# EasyEDA schematic pixelpal.json

## Sheets
1 SHEET1: TITLE: SHEET1; REV: 1.0; Date: 2025-04-19; Sheet: 1/1; Drawn By: yasithlokuge; Company: Your Company
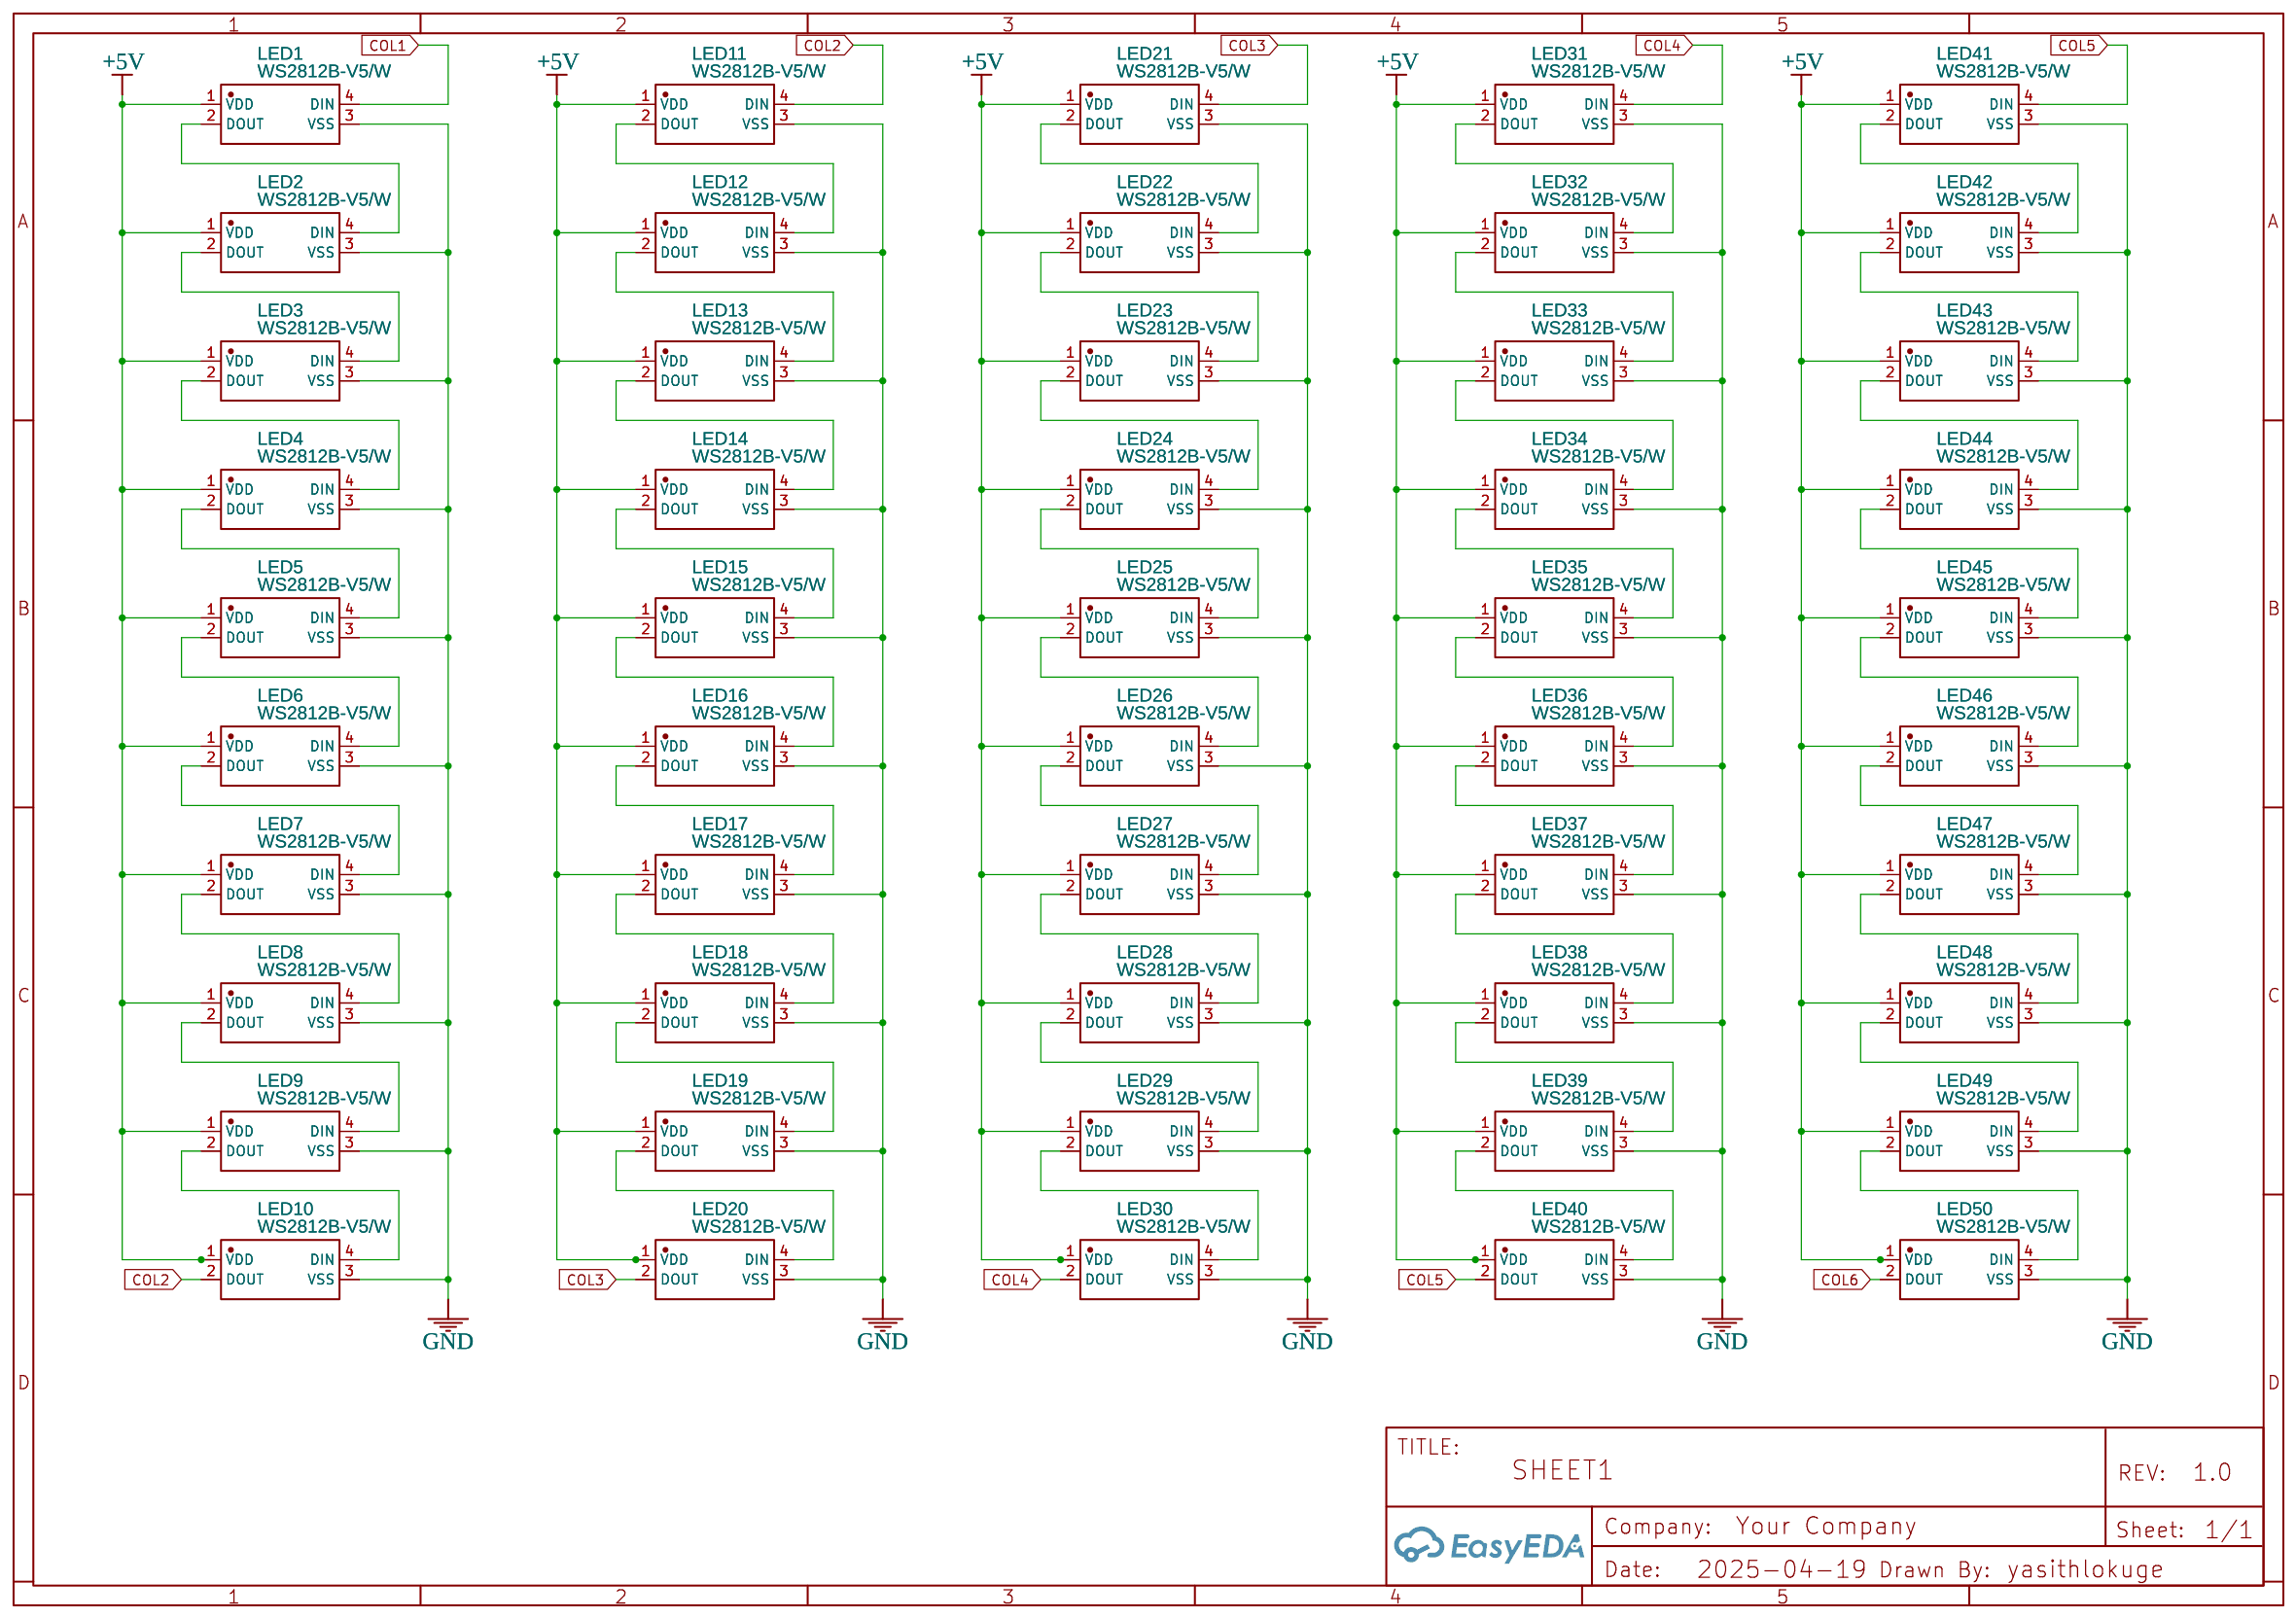
[diagram p0: SHEET1]
2 SHEET2
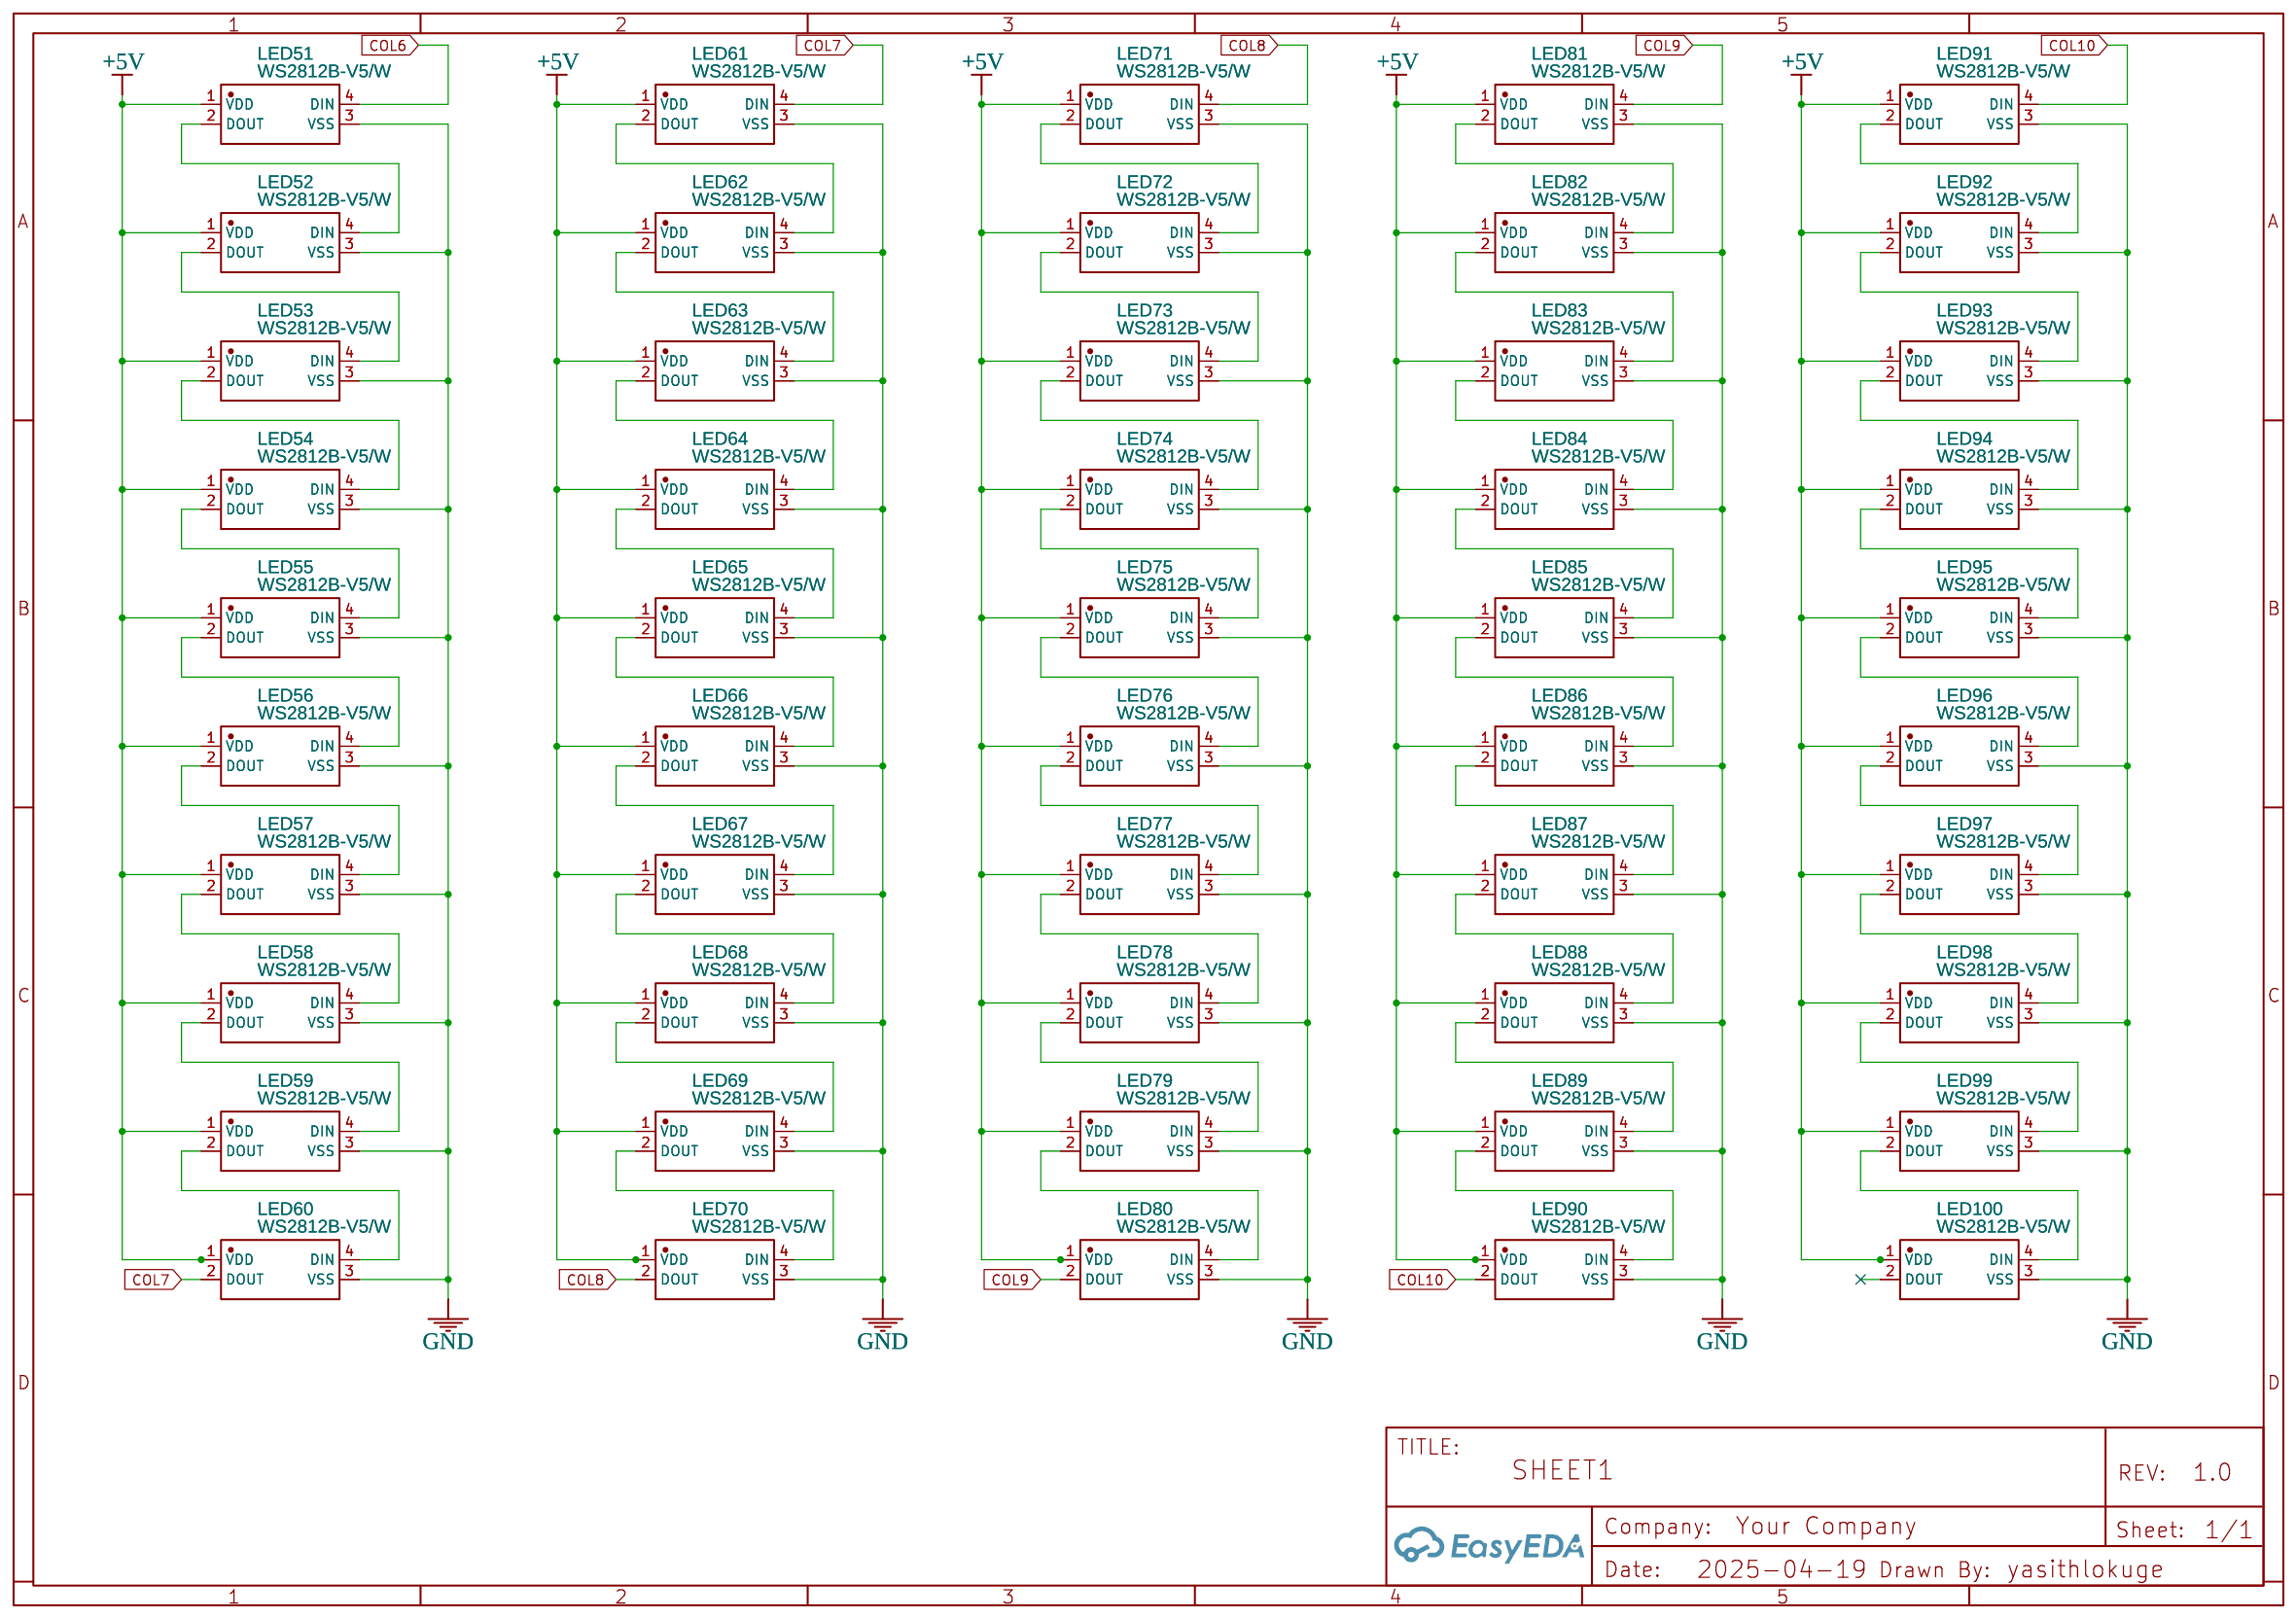
[diagram p1: SHEET2]
3 SHEET3: TITLE: Sheet_3; Date: 2025-04-22
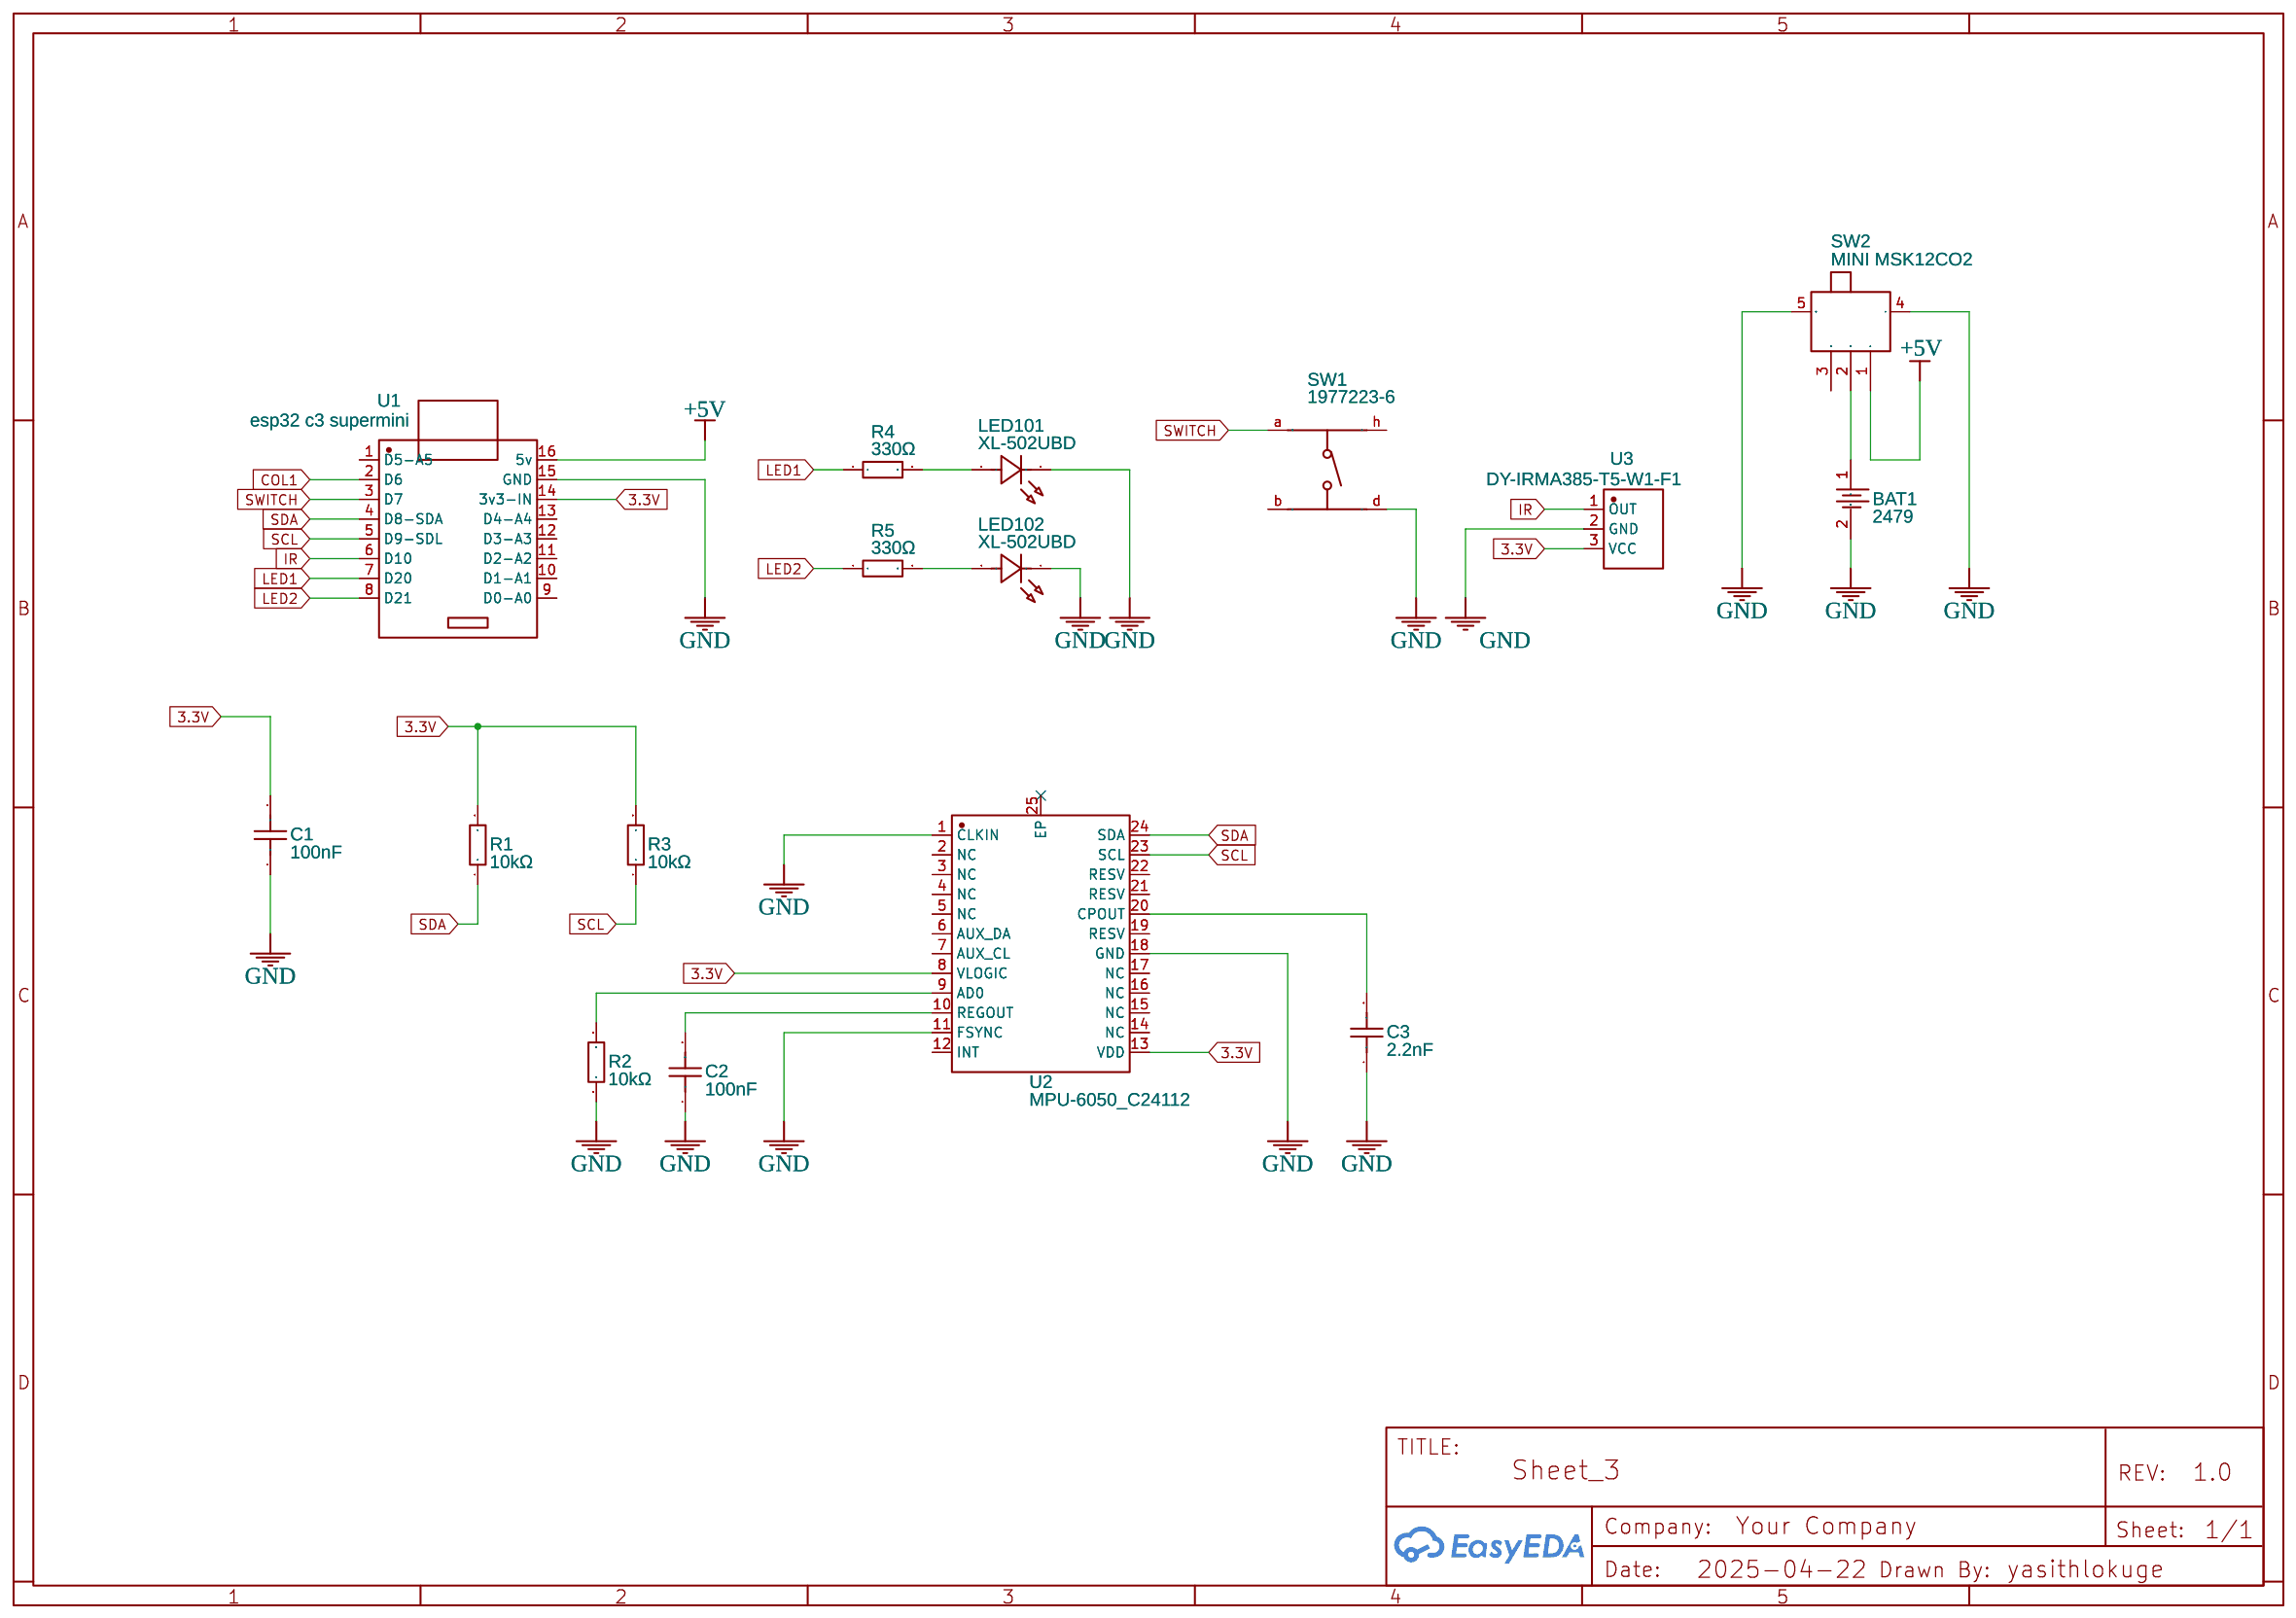
[diagram p2: SHEET3]

## Parts
sheet SHEET1
LED1  WS2812B-V5/W  [LED-SMD_4P-L5.0-W5.0-TL-1]
LED2  WS2812B-V5/W  [LED-SMD_4P-L5.0-W5.0-TL-1]
LED3  WS2812B-V5/W  [LED-SMD_4P-L5.0-W5.0-TL-1]
LED4  WS2812B-V5/W  [LED-SMD_4P-L5.0-W5.0-TL-1]
LED5  WS2812B-V5/W  [LED-SMD_4P-L5.0-W5.0-TL-1]
LED6  WS2812B-V5/W  [LED-SMD_4P-L5.0-W5.0-TL-1]
LED7  WS2812B-V5/W  [LED-SMD_4P-L5.0-W5.0-TL-1]
LED8  WS2812B-V5/W  [LED-SMD_4P-L5.0-W5.0-TL-1]
LED9  WS2812B-V5/W  [LED-SMD_4P-L5.0-W5.0-TL-1]
LED10  WS2812B-V5/W  [LED-SMD_4P-L5.0-W5.0-TL-1]
LED11  WS2812B-V5/W  [LED-SMD_4P-L5.0-W5.0-TL-1]
LED12  WS2812B-V5/W  [LED-SMD_4P-L5.0-W5.0-TL-1]
LED13  WS2812B-V5/W  [LED-SMD_4P-L5.0-W5.0-TL-1]
LED14  WS2812B-V5/W  [LED-SMD_4P-L5.0-W5.0-TL-1]
LED15  WS2812B-V5/W  [LED-SMD_4P-L5.0-W5.0-TL-1]
LED16  WS2812B-V5/W  [LED-SMD_4P-L5.0-W5.0-TL-1]
LED17  WS2812B-V5/W  [LED-SMD_4P-L5.0-W5.0-TL-1]
LED18  WS2812B-V5/W  [LED-SMD_4P-L5.0-W5.0-TL-1]
LED19  WS2812B-V5/W  [LED-SMD_4P-L5.0-W5.0-TL-1]
LED20  WS2812B-V5/W  [LED-SMD_4P-L5.0-W5.0-TL-1]
LED21  WS2812B-V5/W  [LED-SMD_4P-L5.0-W5.0-TL-1]
LED22  WS2812B-V5/W  [LED-SMD_4P-L5.0-W5.0-TL-1]
LED23  WS2812B-V5/W  [LED-SMD_4P-L5.0-W5.0-TL-1]
LED24  WS2812B-V5/W  [LED-SMD_4P-L5.0-W5.0-TL-1]
LED25  WS2812B-V5/W  [LED-SMD_4P-L5.0-W5.0-TL-1]
LED26  WS2812B-V5/W  [LED-SMD_4P-L5.0-W5.0-TL-1]
LED27  WS2812B-V5/W  [LED-SMD_4P-L5.0-W5.0-TL-1]
LED28  WS2812B-V5/W  [LED-SMD_4P-L5.0-W5.0-TL-1]
LED29  WS2812B-V5/W  [LED-SMD_4P-L5.0-W5.0-TL-1]
LED30  WS2812B-V5/W  [LED-SMD_4P-L5.0-W5.0-TL-1]
LED31  WS2812B-V5/W  [LED-SMD_4P-L5.0-W5.0-TL-1]
LED32  WS2812B-V5/W  [LED-SMD_4P-L5.0-W5.0-TL-1]
LED33  WS2812B-V5/W  [LED-SMD_4P-L5.0-W5.0-TL-1]
LED34  WS2812B-V5/W  [LED-SMD_4P-L5.0-W5.0-TL-1]
LED35  WS2812B-V5/W  [LED-SMD_4P-L5.0-W5.0-TL-1]
LED36  WS2812B-V5/W  [LED-SMD_4P-L5.0-W5.0-TL-1]
LED37  WS2812B-V5/W  [LED-SMD_4P-L5.0-W5.0-TL-1]
LED38  WS2812B-V5/W  [LED-SMD_4P-L5.0-W5.0-TL-1]
LED39  WS2812B-V5/W  [LED-SMD_4P-L5.0-W5.0-TL-1]
LED40  WS2812B-V5/W  [LED-SMD_4P-L5.0-W5.0-TL-1]
LED41  WS2812B-V5/W  [LED-SMD_4P-L5.0-W5.0-TL-1]
LED42  WS2812B-V5/W  [LED-SMD_4P-L5.0-W5.0-TL-1]
LED43  WS2812B-V5/W  [LED-SMD_4P-L5.0-W5.0-TL-1]
LED44  WS2812B-V5/W  [LED-SMD_4P-L5.0-W5.0-TL-1]
LED45  WS2812B-V5/W  [LED-SMD_4P-L5.0-W5.0-TL-1]
LED46  WS2812B-V5/W  [LED-SMD_4P-L5.0-W5.0-TL-1]
LED47  WS2812B-V5/W  [LED-SMD_4P-L5.0-W5.0-TL-1]
LED48  WS2812B-V5/W  [LED-SMD_4P-L5.0-W5.0-TL-1]
LED49  WS2812B-V5/W  [LED-SMD_4P-L5.0-W5.0-TL-1]
LED50  WS2812B-V5/W  [LED-SMD_4P-L5.0-W5.0-TL-1]
sheet SHEET2
LED51  WS2812B-V5/W  [LED-SMD_4P-L5.0-W5.0-TL-1]
LED52  WS2812B-V5/W  [LED-SMD_4P-L5.0-W5.0-TL-1]
LED53  WS2812B-V5/W  [LED-SMD_4P-L5.0-W5.0-TL-1]
LED54  WS2812B-V5/W  [LED-SMD_4P-L5.0-W5.0-TL-1]
LED55  WS2812B-V5/W  [LED-SMD_4P-L5.0-W5.0-TL-1]
LED56  WS2812B-V5/W  [LED-SMD_4P-L5.0-W5.0-TL-1]
LED57  WS2812B-V5/W  [LED-SMD_4P-L5.0-W5.0-TL-1]
LED58  WS2812B-V5/W  [LED-SMD_4P-L5.0-W5.0-TL-1]
LED59  WS2812B-V5/W  [LED-SMD_4P-L5.0-W5.0-TL-1]
LED60  WS2812B-V5/W  [LED-SMD_4P-L5.0-W5.0-TL-1]
LED61  WS2812B-V5/W  [LED-SMD_4P-L5.0-W5.0-TL-1]
LED62  WS2812B-V5/W  [LED-SMD_4P-L5.0-W5.0-TL-1]
LED63  WS2812B-V5/W  [LED-SMD_4P-L5.0-W5.0-TL-1]
LED64  WS2812B-V5/W  [LED-SMD_4P-L5.0-W5.0-TL-1]
LED65  WS2812B-V5/W  [LED-SMD_4P-L5.0-W5.0-TL-1]
LED66  WS2812B-V5/W  [LED-SMD_4P-L5.0-W5.0-TL-1]
LED67  WS2812B-V5/W  [LED-SMD_4P-L5.0-W5.0-TL-1]
LED68  WS2812B-V5/W  [LED-SMD_4P-L5.0-W5.0-TL-1]
LED69  WS2812B-V5/W  [LED-SMD_4P-L5.0-W5.0-TL-1]
LED70  WS2812B-V5/W  [LED-SMD_4P-L5.0-W5.0-TL-1]
LED71  WS2812B-V5/W  [LED-SMD_4P-L5.0-W5.0-TL-1]
LED72  WS2812B-V5/W  [LED-SMD_4P-L5.0-W5.0-TL-1]
LED73  WS2812B-V5/W  [LED-SMD_4P-L5.0-W5.0-TL-1]
LED74  WS2812B-V5/W  [LED-SMD_4P-L5.0-W5.0-TL-1]
LED75  WS2812B-V5/W  [LED-SMD_4P-L5.0-W5.0-TL-1]
LED76  WS2812B-V5/W  [LED-SMD_4P-L5.0-W5.0-TL-1]
LED77  WS2812B-V5/W  [LED-SMD_4P-L5.0-W5.0-TL-1]
LED78  WS2812B-V5/W  [LED-SMD_4P-L5.0-W5.0-TL-1]
LED79  WS2812B-V5/W  [LED-SMD_4P-L5.0-W5.0-TL-1]
LED80  WS2812B-V5/W  [LED-SMD_4P-L5.0-W5.0-TL-1]
LED81  WS2812B-V5/W  [LED-SMD_4P-L5.0-W5.0-TL-1]
LED82  WS2812B-V5/W  [LED-SMD_4P-L5.0-W5.0-TL-1]
LED83  WS2812B-V5/W  [LED-SMD_4P-L5.0-W5.0-TL-1]
LED84  WS2812B-V5/W  [LED-SMD_4P-L5.0-W5.0-TL-1]
LED85  WS2812B-V5/W  [LED-SMD_4P-L5.0-W5.0-TL-1]
LED86  WS2812B-V5/W  [LED-SMD_4P-L5.0-W5.0-TL-1]
LED87  WS2812B-V5/W  [LED-SMD_4P-L5.0-W5.0-TL-1]
LED88  WS2812B-V5/W  [LED-SMD_4P-L5.0-W5.0-TL-1]
LED89  WS2812B-V5/W  [LED-SMD_4P-L5.0-W5.0-TL-1]
LED90  WS2812B-V5/W  [LED-SMD_4P-L5.0-W5.0-TL-1]
LED91  WS2812B-V5/W  [LED-SMD_4P-L5.0-W5.0-TL-1]
LED92  WS2812B-V5/W  [LED-SMD_4P-L5.0-W5.0-TL-1]
LED93  WS2812B-V5/W  [LED-SMD_4P-L5.0-W5.0-TL-1]
LED94  WS2812B-V5/W  [LED-SMD_4P-L5.0-W5.0-TL-1]
LED95  WS2812B-V5/W  [LED-SMD_4P-L5.0-W5.0-TL-1]
LED96  WS2812B-V5/W  [LED-SMD_4P-L5.0-W5.0-TL-1]
LED97  WS2812B-V5/W  [LED-SMD_4P-L5.0-W5.0-TL-1]
LED98  WS2812B-V5/W  [LED-SMD_4P-L5.0-W5.0-TL-1]
LED99  WS2812B-V5/W  [LED-SMD_4P-L5.0-W5.0-TL-1]
LED100  WS2812B-V5/W  [LED-SMD_4P-L5.0-W5.0-TL-1]
sheet SHEET3
BAT1  2479  [BAT-TH_2479]
C1  100nF  [C0402]
C2  100nF  [C0402]
C3  2.2nF  [C0402]
LED101  XL-502UBD  [LED-TH_BD5.9-P2.54-RD_BLUE]
LED102  XL-502UBD  [LED-TH_BD5.9-P2.54-RD_BLUE]
R1  10kΩ  [R0603]
R2  10kΩ  [R0603]
R3  10kΩ  [R0603]
R4  330Ω  [R0603]
R5  330Ω  [R0603]
SW1  1977223-6  [SW-SMD_4P-L6.0-W6.0-P4.50-LS10.0]
SW2  MINI MSK12CO2  [SW-SMD_MSK12CO2]
U1  esp32 c3 supermini  [ESP32-C3-SUPER-MINI]
U2  MPU-6050_C24112  [QFN-24_L4.0-W4.0-P0.50-BL-EP2.7]
U3  DY-IRMA385-T5-W1-F1  [IR-SMD_3P-L4.0-W4.0-P1.27-LS6.8]

## Library data of the parts
LED1-LED100 = WS2812B-V5/W: Contributor: lcsc; Supplier: LCSC; Supplier Part: C2874885; Manufacturer: worldsemi; JLCPCB Part Class: Extended Part
BAT1 = 2479: Supplier: LCSC; Supplier Part: C5370880; Manufacturer: Keystone; JLCPCB Part Class: Extended Part; Contributor: lcsc
C1 C2 = CL05B104KP5VPNC: Supplier: LCSC; Supplier Part: C16193311; Manufacturer: SAMSUNG(三星); Contributor: lcsc; JLCPCB Part Class: Extended Part
C3 = GRM1555C1H222GA01D: Contributor: lcsc; Supplier: LCSC; Supplier Part: C2987940; Manufacturer: muRata(村田)
LED101 LED102 = XL-502UBD: Contributor: lcsc; Supplier: LCSC; Supplier Part: C2895496; Manufacturer: XINGLIGHT(成兴光); JLCPCB Part Class: Extended Part
R1-R3 = ERJ3RBD1002V: Contributor: LCSC; Supplier: LCSC; Supplier Part: C191318; Manufacturer: PANASONIC(松下); JLCPCB Part Class: Extended Part
R4 R5 = 330R 5% 0603: Supplier: LCSC; Manufacturer Part: RS-03K331JT; Manufacturer: FH(风华); Supplier Part: C22104; JLCPCB Part Class: Extended Part
SW1 = 1977223-6: Contributor: LCSC; Supplier: LCSC; Supplier Part: C2928194; Manufacturer: TE Connectivity(泰科电子); JLCPCB Part Class: Extended Part
SW2 = MINI MSK12CO2: Contributor: LCSC; Supplier: LCSC; Supplier Part: C2681570; Manufacturer: SHOU HAN(首韩); JLCPCB Part Class: Extended Part
U1 = esp32 c3 supermini: Contributor: Pgran; Supplier: LCSC; Supplier Part: C477830; Manufacturer: Wireless-tag(启明云端); Manufacturer Part: WT8266-S6 ESP-12S; JLCPCB Part Class: Extended Part
U2 = MPU-6050_C24112: sourceId: 1T5FDZYC8; Supplier: LCSC; Manufacturer: TDK InvenSense(应美盛); Manufacturer Part: MPU-6050; Supplier Part: C24112; JLCPCB Part Class: Extended Part
U3 = DY-IRMA385-T5-W1-F1: Supplier: LCSC; Supplier Part: C7433009; Manufacturer: TONYU(东裕); Contributor: lcsc; JLCPCB Part Class: Extended Part

## Nets
3.3V: C1.2 R1.2 R3.2 U1.14(3v3-IN) U2.8(VLOGIC) U2.13(VDD) U3.3(VCC)
+5V: LED1.1(VDD) LED2.1(VDD) LED3.1(VDD) LED4.1(VDD) LED5.1(VDD) LED6.1(VDD) LED7.1(VDD) LED8.1(VDD) LED9.1(VDD) LED10.1(VDD) LED11.1(VDD) LED12.1(VDD) LED13.1(VDD) LED14.1(VDD) LED15.1(VDD) LED16.1(VDD) LED17.1(VDD) LED18.1(VDD) LED19.1(VDD) LED20.1(VDD) LED21.1(VDD) LED22.1(VDD) LED23.1(VDD) LED24.1(VDD) LED25.1(VDD) LED26.1(VDD) LED27.1(VDD) LED28.1(VDD) LED29.1(VDD) LED30.1(VDD) LED31.1(VDD) LED32.1(VDD) LED33.1(VDD) LED34.1(VDD) LED35.1(VDD) LED36.1(VDD) LED37.1(VDD) LED38.1(VDD) LED39.1(VDD) LED40.1(VDD) LED41.1(VDD) LED42.1(VDD) LED43.1(VDD) LED44.1(VDD) LED45.1(VDD) LED46.1(VDD) LED47.1(VDD) LED48.1(VDD) LED49.1(VDD) LED50.1(VDD) LED51.1(VDD) LED52.1(VDD) LED53.1(VDD) LED54.1(VDD) LED55.1(VDD) LED56.1(VDD) LED57.1(VDD) LED58.1(VDD) LED59.1(VDD) LED60.1(VDD) LED61.1(VDD) LED62.1(VDD) LED63.1(VDD) LED64.1(VDD) LED65.1(VDD) LED66.1(VDD) LED67.1(VDD) LED68.1(VDD) LED69.1(VDD) LED70.1(VDD) LED71.1(VDD) LED72.1(VDD) LED73.1(VDD) LED74.1(VDD) LED75.1(VDD) LED76.1(VDD) LED77.1(VDD) LED78.1(VDD) LED79.1(VDD) LED80.1(VDD) LED81.1(VDD) LED82.1(VDD) LED83.1(VDD) LED84.1(VDD) LED85.1(VDD) LED86.1(VDD) LED87.1(VDD) LED88.1(VDD) LED89.1(VDD) LED90.1(VDD) LED91.1(VDD) LED92.1(VDD) LED93.1(VDD) LED94.1(VDD) LED95.1(VDD) LED96.1(VDD) LED97.1(VDD) LED98.1(VDD) LED99.1(VDD) LED100.1(VDD) SW2.1 U1.16(5v)
GND: BAT1.2 C1.1 C2.1 C3.1 LED1.3(VSS) LED2.3(VSS) LED3.3(VSS) LED4.3(VSS) LED5.3(VSS) LED6.3(VSS) LED7.3(VSS) LED8.3(VSS) LED9.3(VSS) LED10.3(VSS) LED11.3(VSS) LED12.3(VSS) LED13.3(VSS) LED14.3(VSS) LED15.3(VSS) LED16.3(VSS) LED17.3(VSS) LED18.3(VSS) LED19.3(VSS) LED20.3(VSS) LED21.3(VSS) LED22.3(VSS) LED23.3(VSS) LED24.3(VSS) LED25.3(VSS) LED26.3(VSS) LED27.3(VSS) LED28.3(VSS) LED29.3(VSS) LED30.3(VSS) LED31.3(VSS) LED32.3(VSS) LED33.3(VSS) LED34.3(VSS) LED35.3(VSS) LED36.3(VSS) LED37.3(VSS) LED38.3(VSS) LED39.3(VSS) LED40.3(VSS) LED41.3(VSS) LED42.3(VSS) LED43.3(VSS) LED44.3(VSS) LED45.3(VSS) LED46.3(VSS) LED47.3(VSS) LED48.3(VSS) LED49.3(VSS) LED50.3(VSS) LED51.3(VSS) LED52.3(VSS) LED53.3(VSS) LED54.3(VSS) LED55.3(VSS) LED56.3(VSS) LED57.3(VSS) LED58.3(VSS) LED59.3(VSS) LED60.3(VSS) LED61.3(VSS) LED62.3(VSS) LED63.3(VSS) LED64.3(VSS) LED65.3(VSS) LED66.3(VSS) LED67.3(VSS) LED68.3(VSS) LED69.3(VSS) LED70.3(VSS) LED71.3(VSS) LED72.3(VSS) LED73.3(VSS) LED74.3(VSS) LED75.3(VSS) LED76.3(VSS) LED77.3(VSS) LED78.3(VSS) LED79.3(VSS) LED80.3(VSS) LED81.3(VSS) LED82.3(VSS) LED83.3(VSS) LED84.3(VSS) LED85.3(VSS) LED86.3(VSS) LED87.3(VSS) LED88.3(VSS) LED89.3(VSS) LED90.3(VSS) LED91.3(VSS) LED92.3(VSS) LED93.3(VSS) LED94.3(VSS) LED95.3(VSS) LED96.3(VSS) LED97.3(VSS) LED98.3(VSS) LED99.3(VSS) LED100.3(VSS) LED101.1(K) LED102.1(K) R2.1 SW1.d SW2.4 SW2.5 U1.15(GND) U2.1(CLKIN) U2.11(FSYNC) U2.18(GND) U3.2(GND)
COL1: LED1.4(DIN) U1.2(D6)
COL2: LED10.2(DOUT) LED11.4(DIN)
COL3: LED20.2(DOUT) LED21.4(DIN)
COL4: LED30.2(DOUT) LED31.4(DIN)
COL5: LED40.2(DOUT) LED41.4(DIN)
COL6: LED50.2(DOUT) LED51.4(DIN)
COL7: LED60.2(DOUT) LED61.4(DIN)
COL8: LED70.2(DOUT) LED71.4(DIN)
COL9: LED80.2(DOUT) LED81.4(DIN)
COL10: LED90.2(DOUT) LED91.4(DIN)
IR: U1.6(D10) U3.1(OUT)
LED1: R4.1 U1.7(D20)
LED2: R5.1 U1.8(D21)
SCL: R3.1 U1.5(D9-SDL) U2.23(SCL)
SDA: R1.1 U1.4(D8-SDA) U2.24(SDA)
SWITCH: SW1.a U1.3(D7)
Net-(BAT1-1): BAT1.1 SW2.2
Net-(C2-2): C2.2 U2.10(REGOUT)
Net-(C3-2): C3.2 U2.20(CPOUT)
Net-(LED1-2): LED1.2(DOUT) LED2.4(DIN)
Net-(LED2-2): LED2.2(DOUT) LED3.4(DIN)
Net-(LED3-2): LED3.2(DOUT) LED4.4(DIN)
Net-(LED4-2): LED4.2(DOUT) LED5.4(DIN)
Net-(LED5-2): LED5.2(DOUT) LED6.4(DIN)
Net-(LED6-2): LED6.2(DOUT) LED7.4(DIN)
Net-(LED7-2): LED7.2(DOUT) LED8.4(DIN)
Net-(LED8-2): LED8.2(DOUT) LED9.4(DIN)
Net-(LED9-2): LED9.2(DOUT) LED10.4(DIN)
Net-(LED11-2): LED11.2(DOUT) LED12.4(DIN)
Net-(LED12-2): LED12.2(DOUT) LED13.4(DIN)
Net-(LED13-2): LED13.2(DOUT) LED14.4(DIN)
Net-(LED14-2): LED14.2(DOUT) LED15.4(DIN)
Net-(LED15-2): LED15.2(DOUT) LED16.4(DIN)
Net-(LED16-2): LED16.2(DOUT) LED17.4(DIN)
Net-(LED17-2): LED17.2(DOUT) LED18.4(DIN)
Net-(LED18-2): LED18.2(DOUT) LED19.4(DIN)
Net-(LED19-2): LED19.2(DOUT) LED20.4(DIN)
Net-(LED21-2): LED21.2(DOUT) LED22.4(DIN)
Net-(LED22-2): LED22.2(DOUT) LED23.4(DIN)
Net-(LED23-2): LED23.2(DOUT) LED24.4(DIN)
Net-(LED24-2): LED24.2(DOUT) LED25.4(DIN)
Net-(LED25-2): LED25.2(DOUT) LED26.4(DIN)
Net-(LED26-2): LED26.2(DOUT) LED27.4(DIN)
Net-(LED27-2): LED27.2(DOUT) LED28.4(DIN)
Net-(LED28-2): LED28.2(DOUT) LED29.4(DIN)
Net-(LED29-2): LED29.2(DOUT) LED30.4(DIN)
Net-(LED31-2): LED31.2(DOUT) LED32.4(DIN)
Net-(LED32-2): LED32.2(DOUT) LED33.4(DIN)
Net-(LED33-2): LED33.2(DOUT) LED34.4(DIN)
Net-(LED34-2): LED34.2(DOUT) LED35.4(DIN)
Net-(LED35-2): LED35.2(DOUT) LED36.4(DIN)
Net-(LED36-2): LED36.2(DOUT) LED37.4(DIN)
Net-(LED37-2): LED37.2(DOUT) LED38.4(DIN)
Net-(LED38-2): LED38.2(DOUT) LED39.4(DIN)
Net-(LED39-2): LED39.2(DOUT) LED40.4(DIN)
Net-(LED41-2): LED41.2(DOUT) LED42.4(DIN)
Net-(LED42-2): LED42.2(DOUT) LED43.4(DIN)
Net-(LED43-2): LED43.2(DOUT) LED44.4(DIN)
Net-(LED44-2): LED44.2(DOUT) LED45.4(DIN)
Net-(LED45-2): LED45.2(DOUT) LED46.4(DIN)
Net-(LED46-2): LED46.2(DOUT) LED47.4(DIN)
Net-(LED47-2): LED47.2(DOUT) LED48.4(DIN)
Net-(LED48-2): LED48.2(DOUT) LED49.4(DIN)
Net-(LED49-2): LED49.2(DOUT) LED50.4(DIN)
Net-(LED51-2): LED51.2(DOUT) LED52.4(DIN)
Net-(LED52-2): LED52.2(DOUT) LED53.4(DIN)
Net-(LED53-2): LED53.2(DOUT) LED54.4(DIN)
Net-(LED54-2): LED54.2(DOUT) LED55.4(DIN)
Net-(LED55-2): LED55.2(DOUT) LED56.4(DIN)
Net-(LED56-2): LED56.2(DOUT) LED57.4(DIN)
Net-(LED57-2): LED57.2(DOUT) LED58.4(DIN)
Net-(LED58-2): LED58.2(DOUT) LED59.4(DIN)
Net-(LED59-2): LED59.2(DOUT) LED60.4(DIN)
Net-(LED61-2): LED61.2(DOUT) LED62.4(DIN)
Net-(LED62-2): LED62.2(DOUT) LED63.4(DIN)
Net-(LED63-2): LED63.2(DOUT) LED64.4(DIN)
Net-(LED64-2): LED64.2(DOUT) LED65.4(DIN)
Net-(LED65-2): LED65.2(DOUT) LED66.4(DIN)
Net-(LED66-2): LED66.2(DOUT) LED67.4(DIN)
Net-(LED67-2): LED67.2(DOUT) LED68.4(DIN)
Net-(LED68-2): LED68.2(DOUT) LED69.4(DIN)
Net-(LED69-2): LED69.2(DOUT) LED70.4(DIN)
Net-(LED71-2): LED71.2(DOUT) LED72.4(DIN)
Net-(LED72-2): LED72.2(DOUT) LED73.4(DIN)
Net-(LED73-2): LED73.2(DOUT) LED74.4(DIN)
Net-(LED74-2): LED74.2(DOUT) LED75.4(DIN)
Net-(LED75-2): LED75.2(DOUT) LED76.4(DIN)
Net-(LED76-2): LED76.2(DOUT) LED77.4(DIN)
Net-(LED77-2): LED77.2(DOUT) LED78.4(DIN)
Net-(LED78-2): LED78.2(DOUT) LED79.4(DIN)
Net-(LED79-2): LED79.2(DOUT) LED80.4(DIN)
Net-(LED81-2): LED81.2(DOUT) LED82.4(DIN)
Net-(LED82-2): LED82.2(DOUT) LED83.4(DIN)
Net-(LED83-2): LED83.2(DOUT) LED84.4(DIN)
Net-(LED84-2): LED84.2(DOUT) LED85.4(DIN)
Net-(LED85-2): LED85.2(DOUT) LED86.4(DIN)
Net-(LED86-2): LED86.2(DOUT) LED87.4(DIN)
Net-(LED87-2): LED87.2(DOUT) LED88.4(DIN)
Net-(LED88-2): LED88.2(DOUT) LED89.4(DIN)
Net-(LED89-2): LED89.2(DOUT) LED90.4(DIN)
Net-(LED91-2): LED91.2(DOUT) LED92.4(DIN)
Net-(LED92-2): LED92.2(DOUT) LED93.4(DIN)
Net-(LED93-2): LED93.2(DOUT) LED94.4(DIN)
Net-(LED94-2): LED94.2(DOUT) LED95.4(DIN)
Net-(LED95-2): LED95.2(DOUT) LED96.4(DIN)
Net-(LED96-2): LED96.2(DOUT) LED97.4(DIN)
Net-(LED97-2): LED97.2(DOUT) LED98.4(DIN)
Net-(LED98-2): LED98.2(DOUT) LED99.4(DIN)
Net-(LED99-2): LED99.2(DOUT) LED100.4(DIN)
Net-(LED101-2): LED101.2(A) R4.2
Net-(LED102-2): LED102.2(A) R5.2
Net-(R2-2): R2.2 U2.9(AD0)

Not connected (* = marked no-connect by the designer): LED100 2(DOUT); SW1 b h; SW2 3; U1 1(D5-A5) 9(D0-A0) 10(D1-A1) 11(D2-A2) 12(D3-A3) 13(D4-A4); U2 2(NC) 3(NC) 4(NC) 5(NC) 6(AUX_DA) 7(AUX_CL) 12(INT) 14(NC) 15(NC) 16(NC) 17(NC) 19(RESV) 21(RESV) 22(RESV) 25(EP)*
